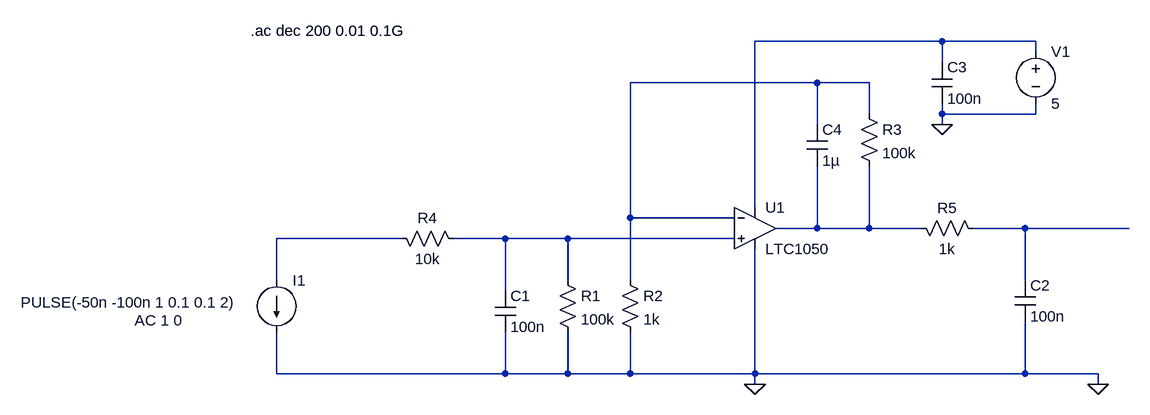
[diagram p0: schematic Adapter_Circuit.asc]
Adapter_Circuit.asc, the LTspice schematic file:
Version 4
SHEET 1 1044 680
WIRE 752 -240 464 -240
WIRE 896 -240 752 -240
WIRE 896 -224 896 -240
WIRE 752 -208 752 -240
WIRE 560 -176 272 -176
WIRE 640 -176 560 -176
WIRE 640 -128 640 -176
WIRE 752 -128 752 -144
WIRE 896 -128 896 -144
WIRE 896 -128 752 -128
WIRE 560 -112 560 -176
WIRE 752 -112 752 -128
WIRE 464 16 464 -240
WIRE 272 32 272 -176
WIRE 432 32 272 32
WIRE 560 48 560 -48
WIRE 560 48 496 48
WIRE 640 48 640 -48
WIRE 640 48 560 48
WIRE 720 48 640 48
WIRE 880 48 800 48
WIRE 1040 48 880 48
WIRE -80 64 -272 64
WIRE 80 64 0 64
WIRE 176 64 80 64
WIRE 432 64 176 64
WIRE -272 128 -272 64
WIRE 176 128 176 64
WIRE 272 128 272 32
WIRE 880 128 880 48
WIRE 80 144 80 64
WIRE -272 272 -272 208
WIRE 80 272 80 208
WIRE 80 272 -272 272
WIRE 176 272 176 208
WIRE 176 272 80 272
WIRE 272 272 272 208
WIRE 272 272 176 272
WIRE 464 272 464 80
WIRE 464 272 272 272
WIRE 880 272 880 192
WIRE 880 272 464 272
WIRE 992 272 880 272
WIRE 464 288 464 272
WIRE 992 288 992 272
FLAG 464 288 0
FLAG 992 288 0
FLAG 752 -112 0
SYMBOL cap 64 144 R0
SYMATTR InstName C1
SYMATTR Value 100n
SYMBOL res 160 112 R0
SYMATTR InstName R1
SYMATTR Value 100k
SYMBOL res 256 112 R0
SYMATTR InstName R2
SYMATTR Value 1k
SYMBOL res 16 80 M270
WINDOW 0 32 56 VTop 2
WINDOW 3 0 56 VBottom 2
SYMATTR InstName R4
SYMATTR Value 10k
SYMBOL Opamps\\LTC1050 464 -16 R0
SYMATTR InstName U1
SYMBOL cap 544 -112 R0
SYMATTR InstName C4
SYMATTR Value 1µ
SYMBOL res 624 -144 R0
SYMATTR InstName R3
SYMATTR Value 100k
SYMBOL res 704 32 M90
WINDOW 0 0 56 VBottom 2
WINDOW 3 32 56 VTop 2
SYMATTR InstName R5
SYMATTR Value 1k
SYMBOL cap 864 128 R0
SYMATTR InstName C2
SYMATTR Value 100n
SYMBOL cap 736 -208 R0
SYMATTR InstName C3
SYMATTR Value 100n
SYMBOL voltage 896 -240 R0
WINDOW 123 0 0 Left 0
WINDOW 39 0 0 Left 0
SYMATTR InstName V1
SYMATTR Value 5
SYMBOL current -272 128 R0
WINDOW 3 -394 34 Left 2
WINDOW 123 -219 62 Left 2
WINDOW 39 0 0 Left 0
SYMATTR Value PULSE(-50n -100n 1 0.1 0.1 2)
SYMATTR Value2 AC 1 0
SYMATTR InstName I1
TEXT -312 -256 Left 2 !.ac dec 200 0.01 0.1G

The netlist it stands for:
* Adapter_Circuit.asc
C1 N006 0 100n
R1 N006 0 100k
R2 N002 0 1k
R4 N006 N005 10k
XU1 N006 N002 N001 0 N003 LTC1050  ; pins In+ In- V+ V- OUT
C4 N002 N003 1µ
R3 N002 N003 100k
R5 N003 N004 1k
C2 N004 0 100n
C3 N001 0 100n
V1 N001 0 5
I1 N005 0 PULSE(-50n -100n 1 0.1 0.1 2) AC 1 0
.ac dec 200 0.01 0.1G
.lib LTC.lib
.backanno
.end